# EAGLE schematic uzed-hmdi (EAGLE 8.6.1)
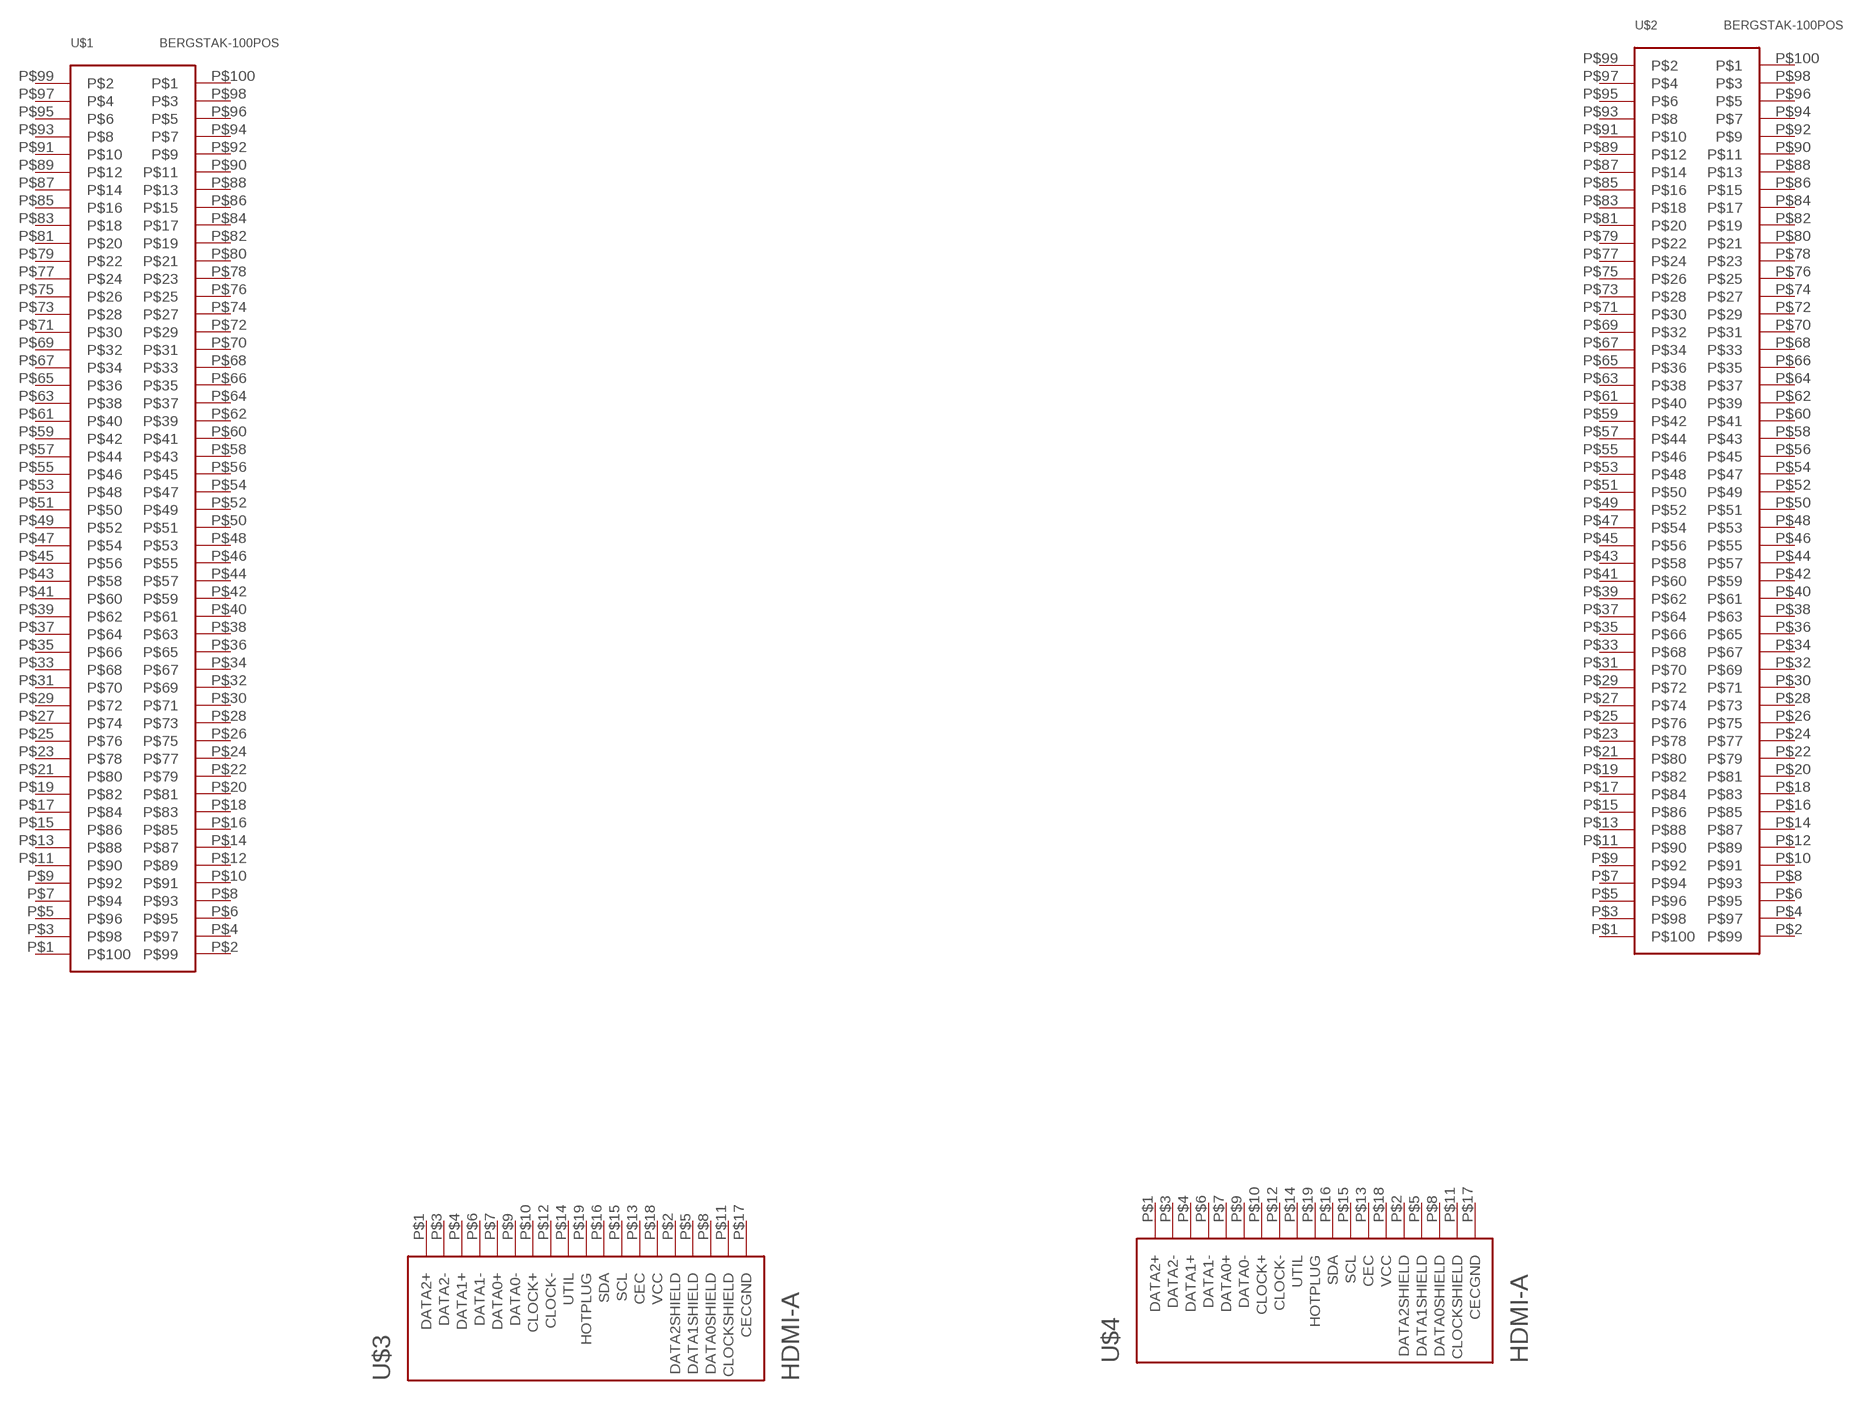
[diagram p0: schematic, sheet 1]

## Parts
U$1  BERGSTAK-100POS  [BERG100POS]
U$2  BERGSTAK-100POS  [BERG100POS]
U$3  HDMI-A  [HDMI_A]
U$4  HDMI-A  [HDMI_A]
Unconnected: U$1.P$1 U$1.P$2 U$1.P$3 U$1.P$4 U$1.P$5 U$1.P$6 U$1.P$7 U$1.P$8 U$1.P$9 U$1.P$10 U$1.P$11 U$1.P$12 U$1.P$13 U$1.P$14 U$1.P$15 U$1.P$16 U$1.P$17 U$1.P$18 U$1.P$19 U$1.P$20 U$1.P$21 U$1.P$22 U$1.P$23 U$1.P$24 U$1.P$25 U$1.P$26 U$1.P$27 U$1.P$28 U$1.P$29 U$1.P$30 U$1.P$31 U$1.P$32 U$1.P$33 U$1.P$34 U$1.P$35 U$1.P$36 U$1.P$37 U$1.P$38 U$1.P$39 U$1.P$40 U$1.P$41 U$1.P$42 U$1.P$43 U$1.P$44 U$1.P$45 U$1.P$46 U$1.P$47 U$1.P$48 U$1.P$49 U$1.P$50 U$1.P$51 U$1.P$52 U$1.P$53 U$1.P$54 U$1.P$55 U$1.P$56 U$1.P$57 U$1.P$58 U$1.P$59 U$1.P$60 U$1.P$61 U$1.P$62 U$1.P$63 U$1.P$64 U$1.P$65 U$1.P$66 U$1.P$67 U$1.P$68 U$1.P$69 U$1.P$70 U$1.P$71 U$1.P$72 U$1.P$73 U$1.P$74 U$1.P$75 U$1.P$76 U$1.P$77 U$1.P$78 U$1.P$79 U$1.P$80 U$1.P$81 U$1.P$82 U$1.P$83 U$1.P$84 U$1.P$85 U$1.P$86 U$1.P$87 U$1.P$88 U$1.P$89 U$1.P$90 U$1.P$91 U$1.P$92 U$1.P$93 U$1.P$94 U$1.P$95 U$1.P$96 U$1.P$97 U$1.P$98 U$1.P$99 U$1.P$100 U$2.P$1 U$2.P$2 U$2.P$3 U$2.P$4 U$2.P$5 U$2.P$6 U$2.P$7 U$2.P$8 U$2.P$9 U$2.P$10 U$2.P$11 U$2.P$12 U$2.P$13 U$2.P$14 U$2.P$15 U$2.P$16 U$2.P$17 U$2.P$18 U$2.P$19 U$2.P$20 U$2.P$21 U$2.P$22 U$2.P$23 U$2.P$24 U$2.P$25 U$2.P$26 U$2.P$27 U$2.P$28 U$2.P$29 U$2.P$30 U$2.P$31 U$2.P$32 U$2.P$33 U$2.P$34 U$2.P$35 U$2.P$36 U$2.P$37 U$2.P$38 U$2.P$39 U$2.P$40 U$2.P$41 U$2.P$42 U$2.P$43 U$2.P$44 U$2.P$45 U$2.P$46 U$2.P$47 U$2.P$48 U$2.P$49 U$2.P$50 U$2.P$51 U$2.P$52 U$2.P$53 U$2.P$54 U$2.P$55 U$2.P$56 U$2.P$57 U$2.P$58 U$2.P$59 U$2.P$60 U$2.P$61 U$2.P$62 U$2.P$63 U$2.P$64 U$2.P$65 U$2.P$66 U$2.P$67 U$2.P$68 U$2.P$69 U$2.P$70 U$2.P$71 U$2.P$72 U$2.P$73 U$2.P$74 U$2.P$75 U$2.P$76 U$2.P$77 U$2.P$78 U$2.P$79 U$2.P$80 U$2.P$81 U$2.P$82 U$2.P$83 U$2.P$84 U$2.P$85 U$2.P$86 U$2.P$87 U$2.P$88 U$2.P$89 U$2.P$90 U$2.P$91 U$2.P$92 U$2.P$93 U$2.P$94 U$2.P$95 U$2.P$96 U$2.P$97 U$2.P$98 U$2.P$99 U$2.P$100 U$3.P$1(DATA2+) U$3.P$2(DATA2SHIELD) U$3.P$3(DATA2-) U$3.P$4(DATA1+) U$3.P$5(DATA1SHIELD) U$3.P$6(DATA1-) U$3.P$7(DATA0+) U$3.P$8(DATA0SHIELD) U$3.P$9(DATA0-) U$3.P$10(CLOCK+) U$3.P$11(CLOCKSHIELD) U$3.P$12(CLOCK-) U$3.P$13(CEC) U$3.P$14(UTIL) U$3.P$15(SCL) U$3.P$16(SDA) U$3.P$17(CECGND) U$3.P$18(VCC) U$3.P$19(HOTPLUG) U$4.P$1(DATA2+) U$4.P$2(DATA2SHIELD) U$4.P$3(DATA2-) U$4.P$4(DATA1+) U$4.P$5(DATA1SHIELD) U$4.P$6(DATA1-) U$4.P$7(DATA0+) U$4.P$8(DATA0SHIELD) U$4.P$9(DATA0-) U$4.P$10(CLOCK+) U$4.P$11(CLOCKSHIELD) U$4.P$12(CLOCK-) U$4.P$13(CEC) U$4.P$14(UTIL) U$4.P$15(SCL) U$4.P$16(SDA) U$4.P$17(CECGND) U$4.P$18(VCC) U$4.P$19(HOTPLUG)

## Library data of the parts
U$1 U$2 = lupa300-components:BERGSTAK-100POS
U$3 U$4 = new-connectors:HDMI-A: Horizonal HDMI type "A" jack